# Altium schematic sheet Adafruit SMT Datalogger Shield rev C.SchDoc: Edit Title Parameter
size 270 x 207 mm; Date: 1/7/2019 12:02:16 PM; Engineer: G. Lansberry; Organization: Wyss Institute at Harvard; Address1: 3 Blackfan Circle; Address2: Boston, MA 02115; Address3: USA; SheetNumber: X; SheetTotal: Y
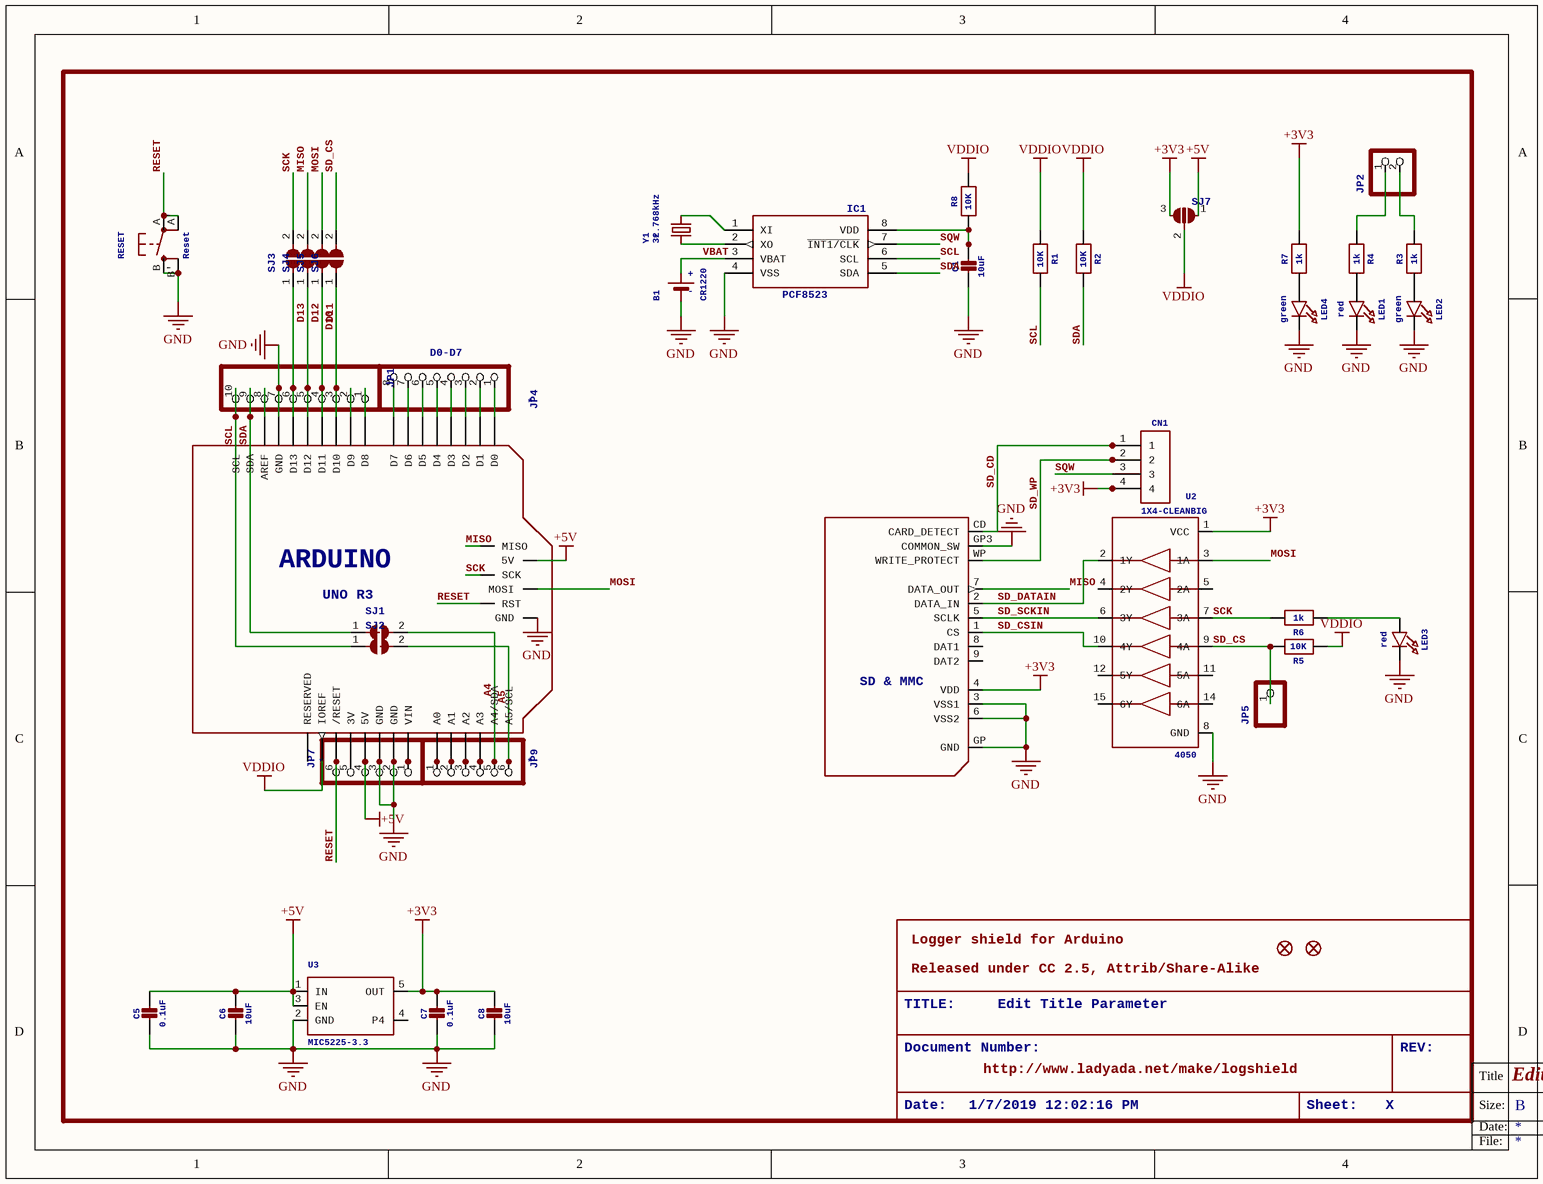
[diagram p0: Adafruit SMT Datalogger Shield rev C.SchDoc]

## Parts
B1  CR1220  [CR1220]
C1  10uF  [0805-NO]
C5  0.1uF  [0805-NO]
C6  10uF  [0805-NO]
C7  0.1uF  [0805-NO]
C8  10uF  [0805-NO]
CN1  1X4-CLEANBIG  [1X04-CLEANBIG]
FID1  FIDUCIAL_1MM  [FIDUCIAL_1MM]  (value not drawn)
FID3  FIDUCIAL_1MM  [FIDUCIAL_1MM]  (value not drawn)
IC1  PCF8523T  [SOIC8_150MIL]  (value not drawn)
JP1  HEADER-1X1070MIL  [1X10_ROUND70]  (value not drawn)
JP2  HEADER-1X2ROUND  [1X02_ROUND]  (value not drawn)
JP4  D0-D7  [1X08-BIG]
JP5  HEADER-1X1ROUND  [1X01_ROUND]  (value not drawn)
JP7  PINHD-1X6B  [1X06-BIG]  (value not drawn)
JP9  PINHD-1X6B  [1X06-BIG]  (value not drawn)
LED1  red  [CHIPLED_0805_NOOUTLINE]
LED2  green  [CHIPLED_0805_NOOUTLINE]
LED3  red  [CHIPLED_0805_NOOUTLINE]
LED4  green  [CHIPLED_0805_NOOUTLINE]
M1  UNOR3: UNO R3  [ARDUINOR3_ICSP_NODIM]  (hidden comment: ARDUINO_R3_ICSP_NODIM)
R1  10K  [0805-NO]
R2  10K  [0805-NO]
R3  1k  [0805-NO]
R4  1k  [0805-NO]
R5  10K  [0805-NO]
R6  1k  [0805-NO]
R7  1k  [0805-NO]
R8  10K  [0805-NO]
RESET  Reset  [EVQ-Q2_SMALLER]
SJ1  SOLDERJUMPER  [SOLDERJUMPER_ARROW_NOPASTE]  (value not drawn)
SJ2  SOLDERJUMPER  [SOLDERJUMPER_ARROW_NOPASTE]  (value not drawn)
SJ3  SOLDERJUMPER  [SOLDERJUMPER_ARROW_NOPASTE]  (value not drawn)
SJ4  SOLDERJUMPER  [SOLDERJUMPER_ARROW_NOPASTE]  (value not drawn)
SJ5  SOLDERJUMPER  [SOLDERJUMPER_ARROW_NOPASTE]  (value not drawn)
SJ6  SOLDERJUMPERCLOSED  [SOLDERJUMPER_CLOSEDWIRE]  (value not drawn)
SJ7  SOLDERJUMPER_2WAY  [SOLDERJUMPER_2WAY_OPEN_NOPASTE]  (value not drawn)
U2  4050  [SOIC16]
U3  MIC5225-3.3  [SOT23-5]
U$2  SD&MMC: SD & MMC  [06132]  (hidden comment: SDMMC06132)
Y1  32.768kHz  [CRYSTAL_8X3.8]

## Nets
+3V3: C7.1 C8.1 CN1.4 R7.2 SJ7.3 U2.1(VCC) U3.5(OUT) U$2.4(VDD)
+5V: C5.1 C6.1 JP7.4 M1.5V M1.5V_ICSP(5V) SJ7.1 U3.1(IN) U3.3(EN)
GND: B1.- C1.2 C5.2 C6.2 C7.2 C8.2 IC1.4(VSS) JP1.7 JP7.2 JP7.3 LED1.C LED2.C LED3.C LED4.C M1.GND M1.GND@1(GND) M1.GND@2(GND) M1.GND@3(GND) RESET.B(S) RESET.B'(S1) U2.8(GND) U3.2(GND) U$2.3(VSS1) U$2.6(VSS2) U$2.GP(GND) U$2.GP3(COMMON_SW)
VDDIO: M1.IOREF R1.1 R2.1 R5.1 R8.2 SJ7.2
A4: JP9.5 M1.A4(A4/SDA) SJ1.2
A5: JP9.6 M1.A5(A5/SCL) SJ2.2
D10: JP1.3 M1.D10 SJ6.1
D11: JP1.4 M1.D11 SJ5.1
D12: JP1.5 M1.D12 SJ4.1
D13: JP1.6 M1.D13 SJ3.1
MISO: M1.MISO SJ4.2 U$2.7(DATA_OUT)
MOSI: M1.MOSI SJ5.2 U2.3(1A)
RESET: JP7.6 M1.RESET(/RESET) M1.RESET_ICSP(RST) RESET.A(P) RESET.A'(P1)
SCK: M1.SCK R6.2 SJ3.2 U2.7(3A)
SCL: IC1.6(SCL) JP1.10 M1.SCL R1.2 SJ2.1
SD_CD: CN1.1 U$2.CD(CARD_DETECT)
SD_CS: JP5.1 R5.2 SJ6.2 U2.9(4A)
SD_CSIN: U2.10(4Y) U$2.1(CS)
SD_DATAIN: U2.2(1Y) U$2.2(DATA_IN)
SD_SCKIN: U2.6(3Y) U$2.5(SCLK)
SD_WP: CN1.2 U$2.WP(WRITE_PROTECT)
SDA: IC1.5(SDA) JP1.9 M1.SDA R2.2 SJ1.1
SQW: CN1.3 IC1.7(~{INT1/CLK})
VBAT: B1.+$1_+$2(+) IC1.3(VBAT)
NetC1_1: C1.1 IC1.8(VDD) R8.1
NetIC1_1: IC1.1(XI) Y1.P$4
NetIC1_2: IC1.2(XO) Y1.P$1
NetJP1_1: JP1.1 M1.D8
NetJP1_2: JP1.2 M1.D9
NetJP1_8: JP1.8 M1.AREF
NetJP2_1: JP2.1 R4.1
NetJP2_2: JP2.2 R3.2
NetJP4_1: JP4.1 M1.D0
NetJP4_2: JP4.2 M1.D1
NetJP4_3: JP4.3 M1.D2
NetJP4_4: JP4.4 M1.D3
NetJP4_5: JP4.5 M1.D4
NetJP4_6: JP4.6 M1.D5
NetJP4_7: JP4.7 M1.D6
NetJP4_8: JP4.8 M1.D7
NetJP7_1: JP7.1 M1.VIN
NetJP7_5: JP7.5 M1.3V
NetJP9_1: JP9.1 M1.A0
NetJP9_2: JP9.2 M1.A1
NetJP9_3: JP9.3 M1.A2
NetJP9_4: JP9.4 M1.A3
NetLED1_A: LED1.A R4.2
NetLED2_A: LED2.A R3.1
NetLED3_A: LED3.A R6.1
NetLED4_A: LED4.A R7.1

Not connected (* = marked no-connect by the designer): M1 RESERVED; U2 4(2Y) 5(2A) 11(5A) 12(5Y) 14(6A) 15(6Y); U3 4(P4); U$2 8(DAT1) 9(DAT2)

## Notes on the sheet
- Released under CC 2.5, Attrib/Share-Alike
- Logger shield for Arduino
- TITLE:
- Document Number:
- Edit Title Parameter
- REV:
- Date:
- 1/7/2019 12:02:16 PM
- http://www.ladyada.net/make/logshield
- Sheet:
- X
- Title Block Instructions:
  Items are added/modified by changing parameters. Some are sheet parameters, some are parameters inherited from the project.  These parameters may need to be added via project->project options->properties
  Project properties to add:
  ProjectSCHDocumentNumber
  Sheet Properties to modify
  Title
  Revision
  SheetTotal
  SheetNumber
- Title
- Size:
- B
- Number:
- Time:
- Revision:
- Sheet
- of
- File:

## Library data of the parts
B1 = BATTERYCR1220_SMT: GateName_1: G$1; SymbolName_1: BATTERY; DeviceName: CR1220_SMT; LibraryName: microbuilder; DeviceSetName: BATTERY; +: +; -: -
C1 C5-C8 = CAP_CERAMIC0805-NOOUTLINE: Ceramic CapacitorsFor new designs, use the packages preceded by an '_' character since they are more reliable:The following footprints should be used on most boards:For extremely tight-pitch boards where space is at a premium, the following 'micro-pitch' footprints can be used (smaller pads, no silkscreen outline, etc.):; GateName_1: G$1; SymbolName_1: CAPACITOR; DeviceName: 0805-NOOUTLINE; LibraryName: microbuilder; DeviceSetName: CAP_CERAMIC
CN1 = 1X4-CLEANBIG: 4-pin connector; GateName_1: G$1; SymbolName_1: 1X4; DeviceName: -CLEANBIG; LibraryName: adafruit; DeviceSetName: 1X4
FID1 FID3 = FIDUCIAL_1MM: Fiducial Alignment PointsVarious fiducial points for machine vision alignment.; GateName_1: G$1; DeviceName: _1MM; BOM: EXCLUDE; SymbolName_1: FIDUCIAL; LibraryName: microbuilder; DeviceSetName: FIDUCIAL
IC1 = RTC_PCF8523T: GateName_1: G$1; DeviceName: T; SymbolName_1: PCF8523; LibraryName: microbuilder; DeviceSetName: RTC_PCF8523; PCF8523: PCF8523
JP1 = HEADER-1X1070MIL: PIN HEADER; GateName_1: A; SymbolName_1: PINHD10; DeviceName: 70MIL; LibraryName: microbuilder; DeviceSetName: HEADER-1X10
JP2 = HEADER-1X2ROUND: PIN HEADER; GateName_1: G$1; SymbolName_1: PINHD2; DeviceName: ROUND; LibraryName: microbuilder; DeviceSetName: HEADER-1X2
JP4 = PINHD-1X8BIG: PIN HEADER; GateName_1: G$1; SymbolName_1: PINHD8; DeviceName: BIG; LibraryName: adafruit; DeviceSetName: PINHD-1X8; NAME: *
JP5 = HEADER-1X1ROUND: PIN HEADER; GateName_1: G$1; SymbolName_1: PINHD1; DeviceName: ROUND; LibraryName: microbuilder; DeviceSetName: HEADER-1X1
JP7 JP9 = PINHD-1X6B: PIN HEADER; GateName_1: A; SymbolName_1: PINHD6; DeviceName: B; LibraryName: adafruit; DeviceSetName: PINHD-1X6; NAME: *
LED1-LED4 = LED0805_NOOUTLINE: LED0603 - 0603 Surface Mount Package 2mA:5mA:0805 - 0805 Surface Mount Package 2mA:20mA:; GateName_1: G$1; SymbolName_1: LED; DeviceName: 0805_NOOUTLINE; LibraryName: microbuilder; DeviceSetName: LED
M1 = ARDUINO_R3_ICSP_NODIM: GateName_1: G$1; SymbolName_1: ARDUINOR3-ICSP; DeviceName: _NODIM; LibraryName: adafruit; DeviceSetName: ARDUINO_R3_ICSP; ARDUINO: ARDUINO
R1-R8 = RESISTOR0805_NOOUTLINE: ResistorsFor new designs, use the packages preceded by an '_' character since they are more reliable:The following footprints should be used on most boards:For extremely tight-pitch boards where space is at a premium, the following 'micro-pitch' footprints can be used (smaller pads, no silkscreen outline, etc.):; GateName_1: G$1; SymbolName_1: RESISTOR; DeviceName: 0805_NOOUTLINE; LibraryName: microbuilder; DeviceSetName: RESISTOR
RESET = SWITCH_TACT_SMT_EVQQ2_SMALL: SMT Tact Switches; GateName_1: G$1; SymbolName_1: BUTTON_4PIN; DeviceName: _EVQQ2_SMALL; LibraryName: microbuilder; DeviceSetName: SWITCH_TACT_SMT
SJ1-SJ5 = SOLDERJUMPER: SMD Solder JUMPERSolder the two pads together to create a connection, or remove the solder to break it.REFLOW - Use this footprint for solder paste and reflow ovens.WAVE - Use this footprint for hand-soldering (larger pads). CLOSED - Has a trace between the two pads to ensure it is closed by default.  The trace needs to be cut to disable the jumper, and can be closed again by creating a solder bridge between the two pads.; GateName_1: 1; BOM: EXCLUDE; SymbolName_1: SOLDERJUMPER; LibraryName: microbuilder; DeviceSetName: SOLDERJUMPER
SJ6 = SOLDERJUMPERCLOSED: SMD Solder JUMPERSolder the two pads together to create a connection, or remove the solder to break it.REFLOW - Use this footprint for solder paste and reflow ovens.WAVE - Use this footprint for hand-soldering (larger pads). CLOSED - Has a trace between the two pads to ensure it is closed by default.  The trace needs to be cut to disable the jumper, and can be closed again by creating a solder bridge between the two pads.; GateName_1: 1; SymbolName_1: SOLDERJUMPER; DeviceName: CLOSED; LibraryName: microbuilder; DeviceSetName: SOLDERJUMPER
SJ7 = SOLDERJUMPER_2WAY: 2-Way Solder Jumper; GateName_1: G$1; SymbolName_1: SOLDERJUMPER_2WAY; LibraryName: microbuilder; DeviceSetName: SOLDERJUMPER_2WAY
U2 = 74HC4050D: 6-channel level shifter 74HC4050D - 2V-6V SupplySOIC16TSSOP16; GateName_1: G$1; SymbolName_1: 74HC4050D; LibraryName: microbuilder; DeviceSetName: 74HC4050D
U3 = VREG_SOT23-5: SOT23-5 Fixed Voltage RegulatorsPartCurrent OutV OutV InV DropoutÎ¸JA (Â°C/W)TJ (Â°C)Digikey Part No.  ADP121  150mA  3.3V  3.4-5.5V  0.09V @ 150mA  --  --  ADP121-AUJZ33R7CT-ND  ADP121  150mA  3.0V  3.1-5.5V  0.09V @ 150mA  --  --  ADP121-AUJZ30R7CT-ND  ADP122     300mA  3.3V  3.4-5.5V  0.085V @ 300mA  --  --  ADP122AUJZ-3.3-R7CT-ND  ADP1712     300mA  3.3V  3.5-5.5V  0.17V @ 300mA  --  --  ADP1712AUJZ-3.3-R7TR-ND  AP7311 (Low Cost)  150mA  3.3V  3.5-6V  0.15V @ 150mA  --  --  AP7311-33WG-7DICT-ND  LD39015M18R  150mA  1.8V  1.9V-5.5V  0.08V @ 100mA  --  --  497-6977-1-ND  LP2985A-33DBVR  150mA  3.3V  3.3-16V  0.28V @ 150mA  206  150  296-18479-1-ND  MCP1824T-3302E/OT  300mA  3.3V  3.5V-6V  0.2V @ 300mA  --  --  MCP1824T-3302E/OTCT-ND  MIC5205-2.5YM5 TR  150mA  2.5V  2.7-16V  0.165V @ 150mA  --  --  576-1257-2-ND  MIC5205-3.0YM5 TR  150mA  3.0V  3.2V-16V  0.165V @ 150mA  --  --  576-1258-2-ND  MIC5205-3.3YM5 TR  150mA  3.3V  3.5V-16V  0.165V @ 150mA  --  --  576-1259-2-ND  TPS780330220  150mA  3.3V+2.2V  3.6-5.5V  250mV Max  --  --  296-23332-1-ND  TDA3663/N1,135  100mA  3.3V  3.5-45V  0.18V @ 50mA  --  --  568-5343-1-ND                                Max operating temp can be calculated using Î¸JA, TJ (max junction temperature), and power in watts.  Set the "Maximum Ambient Temperature" until it reaches TJ ("Max Junction Temperature"), which is the absolute limit for safe use of the regulator: Heat Sink Temperature CalculatorFor example, With 12V source into a 3.3V LP2985 and a 30mA load, we are dissipating (12V-3.3V) * 0.03A = 0.261W.  With a Î¸JA of 206 Â°C/W, a TJ of 150Â°C, and 261mW we can safely use the chip without a heat sink up to 75Â°C (=147.1Â°C Junction Temperature).; GateName_1: G$1; SymbolName_1: VREG_SOT23-5; LibraryName: microbuilder; DeviceSetName: VREG_SOT23-5
U$2 = SDMMC06132: SD MMC Card holder4UCON part #06132 - easy to solder; GateName_1: G$1; SymbolName_1: SD-MMC; DeviceSetName: SDMMC; DeviceName: 06132; LibraryName: microbuilder
Y1 = CRYSTAL8.0X3.8: CrystalsHC49UP - Surface Mount Crystal 2.5 x 2.0mm - MEMs SMT Crystal 3.2 x 2.5mm - MEMs SMT Crystal 4.9 x 1.8mm - MEMs SMT Crystal 8.0 x 3.8mm - Surface Mount Crystal Cylinder; GateName_1: G$1; SymbolName_1: CRYSTAL; DeviceName: 8.0X3.8; LibraryName: microbuilder; DeviceSetName: CRYSTAL; NAME: *